# EAGLE design YOTSUBA_-Y-Z_ver.1.2b (EAGLE 9.6.2)
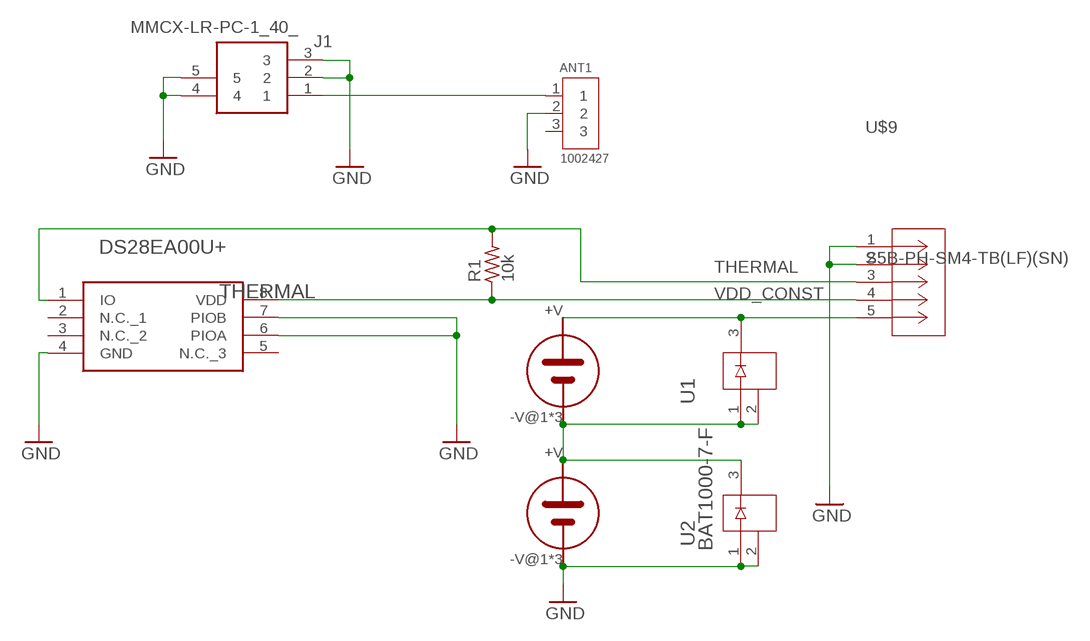
[diagram p0: schematic, sheet 1]

## Parts
ANT1  1002427  [ANTENNA_1002427]
J1  MMCX-LR-PC-1_40_  [MMCXLRPC140]
R1  10k  R-US_R0805  [R0805]
THERMAL  DS28EA00U+  [SOP65P490X110-8N]
U1  BAT1000-7-F  [SOT23_BAT_DIO]
U2  BAT1000-7-F  [SOT23_BAT_DIO]
U$2  3G30A  [SOLAR_3G30A]
U$3  3G30A  [SOLAR_3G30A]
U$9  S5B-PH-SM4-TB(LF)(SN)  [CONN_S5B-PH-SM4-TB_JST]

## Nets
GND [GND]: ANT1.2 J1.2 J1.3 J1.4 J1.5 THERMAL.4(GND) THERMAL.6(PIOA) THERMAL.7(PIOB) U2.1 U2.2 U$3.-V@1(-V) U$3.-V@2(-V) U$3.-V@3(-V) U$9.1 U$9.2
N$5: U1.1 U1.2 U2.3 U$2.-V@1(-V) U$2.-V@2(-V) U$2.-V@3(-V) U$3.+V
N$6: U1.3 U$2.+V U$9.5
RF2 [ANTENNA]: ANT1.1 J1.1
THERMAL: R1.2 THERMAL.1(IO) U$9.3
VDD_CONST: R1.1 THERMAL.8(VDD) U$9.4
Unconnected: ANT1.3 THERMAL.2(N.C._1) THERMAL.3(N.C._2) THERMAL.5(N.C._3)

## Library data of the parts
ANT1 = 1002427:1002427: RF ANT 868MHZ/915MHZ STAMPED MET; DESCRIPTION: 868MHz, 915MHz, 1.575GHz Beidou, GLONASS, GPS, ISM, LoRa, LPWAN, Sigfox Stamped Metal RF Antenna 868MHz, 915MHz, 1.561GHz ~ 1.602GHz 3dBi Solder Surface Mount; DIGI-KEY_PART_NUMBER: 478-1002427TR-ND; MF: Ethertronics/AVX; MP: 1002427; PACKAGE: None; PURCHASE-URL: https://pricing.snapeda.com/search/part/1002427/?ref=eda
J1 = MMCX-LR-PC-1_40_:MMCX-LR-PC-1_40_: RF Connectors / Coaxial Connectors MINI PUSH-ON CONN RECEPT RA Source: Datasheet <https://componentsearchengine.com/Datasheets/1/MMCX-LR-PC-1(40).pdf>; DESCRIPTION: RF Connectors / Coaxial Connectors MINI PUSH-ON CONN RECEPT RA; HEIGHT: 3.95mm; MANUFACTURER_NAME: Hirose; MANUFACTURER_PART_NUMBER: MMCX-LR-PC-1(40); MOUSER_PART_NUMBER: 798-MMCX-LR-PC-1(40); MOUSER_PRICE-STOCK: https://www.mouser.co.uk/ProductDetail/Hirose-Connector/MMCX-LR-PC-140?qs=XQjbzJWzFPVvtPijmLd%2FXQ%3D%3D
R1 = rcl:R-US_: RESISTOR, American symbol; SPICEPREFIX: R
THERMAL = DS28EA00U+:DS28EA00U+: Maxim DS28EA00U+ Temperature Sensor 8-Pin uMAX, -40 +85 C Source: Datasheet <https://datasheets.maximintegrated.com/en/ds/DS28EA00.pdf>; ARROW_PART_NUMBER: DS28EA00U+; ARROW_PRICE-STOCK: https://www.arrow.com/en/products/ds28ea00u/maxim-integrated?region=nac; DESCRIPTION: Maxim DS28EA00U+ Temperature Sensor 8-Pin uMAX, -40 +85 C; HEIGHT: 1.1mm; MANUFACTURER_NAME: Analog Devices; MANUFACTURER_PART_NUMBER: DS28EA00U+; MOUSER_PART_NUMBER: 700-DS28EA00U; MOUSER_PRICE-STOCK: https://www.mouser.co.uk/ProductDetail/Maxim-Integrated/DS28EA00U%2b?qs=7H2Jq%252ByxpJJHHt%2F9DIHuNA%3D%3D
U1 U2 = BAT1000:BAT1000-7-F; COPYRIGHT: Copyright (C) 2023 Ultra Librarian. All rights reserved.; DIGIKEY_PART_NUMBER_1: BAT1000-7FDITR-ND; DIGIKEY_PART_NUMBER_2: BAT1000-7FDICT-ND; DIGIKEY_PART_NUMBER_3: BAT1000-7FDIDKR-ND; MANUFACTURER_PART_NUMBER: BAT1000-7-F; MFR_NAME: Diodes Inc
U$2 U$3 = 3G30A_normal:3G30A
U$9 = S5B-PH-SM4:S5B-PH-SM4-TB(LF)(SN); COPYRIGHT: Copyright (C) 2023 Ultra Librarian. All rights reserved.; DIGIKEY_PART_NUMBER_1: 455-1752-2-ND; DIGIKEY_PART_NUMBER_2: 455-1752-1-ND; DIGIKEY_PART_NUMBER_3: 455-1752-6-ND; MANUFACTURER_PART_NUMBER: S5B-PH-SM4-TB(LF)(SN); MFR_NAME: JST

## Net classes
2 GND: clearance 0.5 mm to class 0, clearance 0.21 mm to class 1, clearance 0.5 mm

## Board
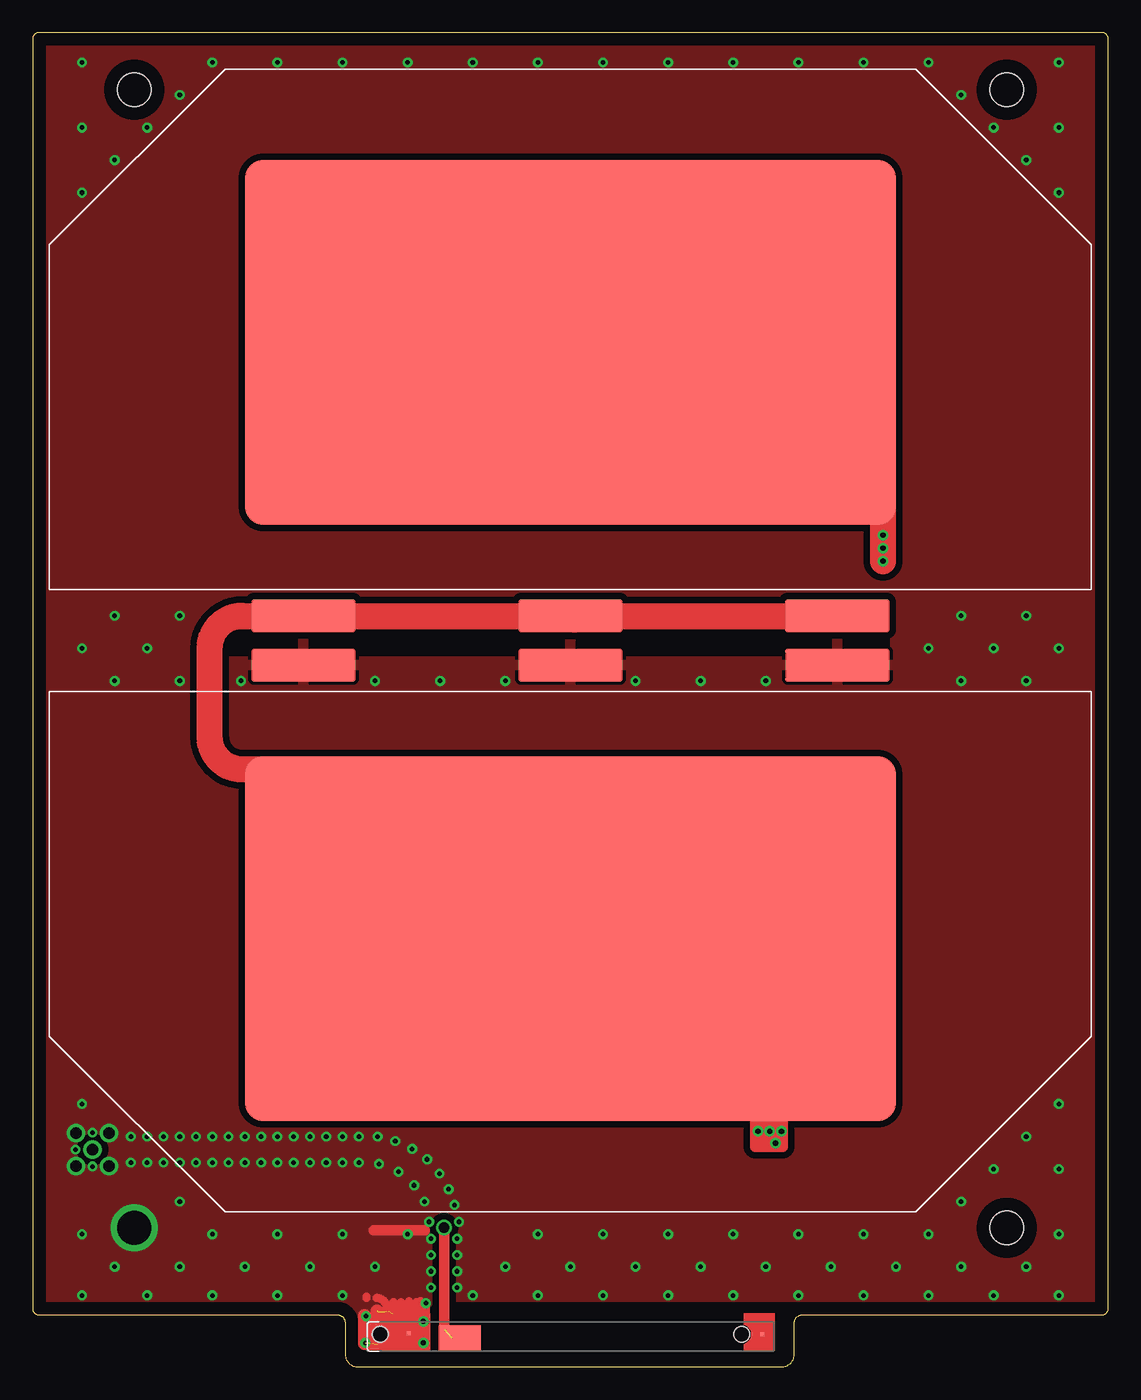
[diagram p1: board, top side]
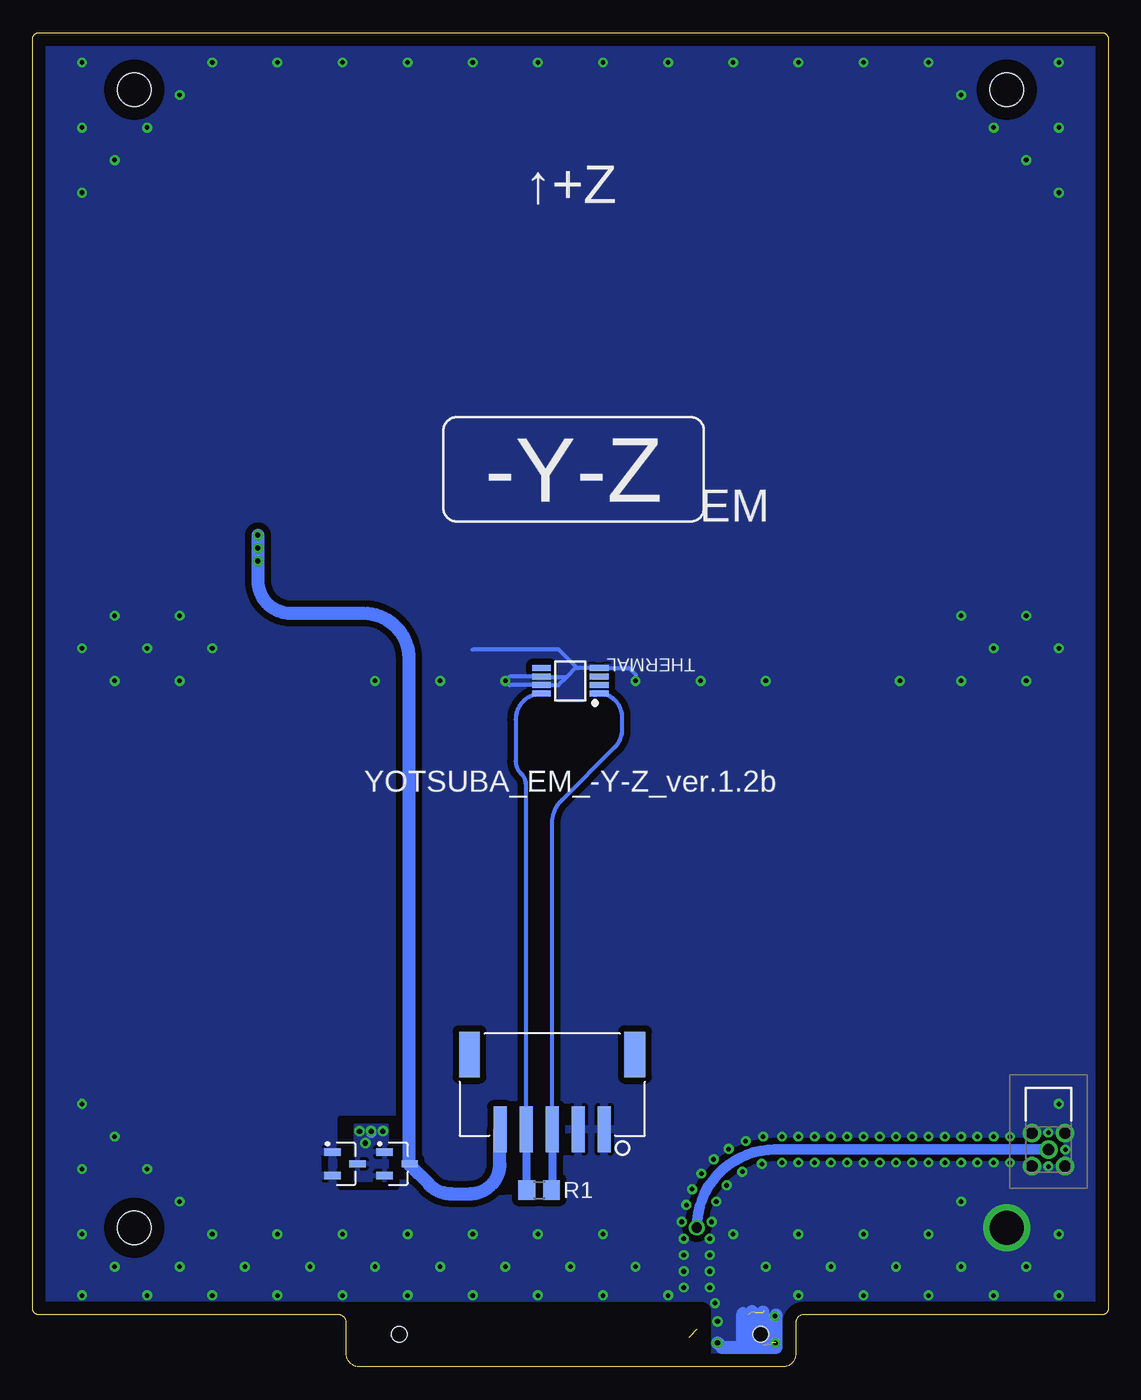
[diagram p2: board, bottom side, seen from below]

Size 82.6 x 102.5 mm. Coordinates in mm from the lower left corner, seen from the top.
Outline: 0,102 0,4.5 arc90 0.5,4 23.4,4 arc-90 24,3.4 24,1 arc90 25,0 57.5,0 arc90 58.5,1 58.5,3.4 arc-90 59.1,4 82.1,4 arc90 82.6,4.5 82.6,102 arc90 82.1,102.5 0.5,102.5 arc90 0,102
Copper layers (1*16): Top 0.035mm / dielectric 1.2mm / Bottom 0.035mm
Design rules "default *": minimum track width 6mil, minimum drill 0.35mm, track to track 6mil, track to pad 6mil, pad to pad 6mil, via to via 6mil, smd to smd 6mil, copper to edge 1mm, drill to drill 6mil, minimum pad ring 10mil, minimum via ring 8mil, stop-mask expansion 4mil, vias tented up to drill 30mil, thermal gap 10mil
Holes 2.6 mm at 74.8,10.7 7.8,98.1 74.8,98.1
tRestrict: 7 lines
bRestrict: 12 lines

### Footprints (pad centres in the part's own frame; a part is rotated, then mirrored left to right if it is on the bottom)
ANTENNA_1002427 = smd 3.2 x 1.9: 1 24.1,-1.05 | smd 0.3 x 0.3: 2 28.02,-1.375; 3 0.875,-1.325 | hole 1.2: 2.46,-1.3; 30.2,-1.3
MMCXLRPC140 = drill 0.9 pad 1.4: 1 0,0; 2 -1.27,-1.27; 3 1.27,-1.27; 4 1.27,1.27; 5 -1.27,1.27
R0805 = smd 1.3 x 1.5: 1 -0.95,0; 2 0.95,0
SOP65P490X110-8N = smd 1.425 x 0.45: 1 -2.212,0.975; 2 -2.212,0.325; 3 -2.212,-0.325; 4 -2.212,-0.975; 5 2.212,-0.975; 6 2.212,-0.325; 7 2.212,0.325; 8 2.212,0.975
SOT23_BAT_DIO = smd 0.568 x 1.259: 1 -0.915,-0.965; 2 0.915,-0.965; 3 0,0.965
SOLAR_3G30A = smd 50 x 28: +V 0,19 | smd 8 x 2.5: -V@1 -20.5,-2; -V@2 20.5,-2; -V@3 0,-2
CONN_S5B-PH-SM4-TB_JST = smd 0.991 x 3.505: 1 4,-3.453; 2 2,-3.453; 3 0,-3.453; 4 -2,-3.453; 5 -4,-3.453 | smd 1.6 x 3.505: 6 -6.35,2.297; 7 6.35,2.297

### Placement (x,y rotation side)
ANT1  56.9,1.2 180 top
J1  4.6,16.7 90 bottom
R1  43.7,13.6 0 bottom
THERMAL  41.3,52.7 180 bottom
U1  54.6,15.6 270 bottom
U2  58.6,15.6 270 bottom
U$2  41.3,59.7 0 top
U$3  41.3,51.9 180 top
U$9  42.7,21.7 0 bottom

### Tracks (layer width: path | path; a pad name or v marks a point on that pad's centre or on a via)
GND  (via drill 0.35, 0.4, 2.6)  (6 unrouted)
  Top 0.6: 30.18,3.58 30.1,3.5 v30,3.5 | 25.65,5.3 25.65,5.4 | ANT1.2 28.6,2.85 | 28.6,2.85 27.78,3.67 27.22,3.67 27.22,4.48 | 27.22,4.48 arc90 26.4,5.3 arc-90 27.22,4.48 | 28.6,2.85 28.4,2.85 28.4,3.8 | 27.7,4.05 27.7,5 | 28.3,4.05 28.3,5 | 28.9,4.1 28.9,5.05 | 29.5,4.05 29.5,5 | 29.8,4.1 29.8,5.05
  Top 0.64: 30.18,3.58 30.18,4.78
  Top 0.8: 30.1,10.5 26.2,10.5
  Top 1: 25.9,1.8 25.88,1.83 25.85,1.85 | 25.5,3.95 25.5,1.8 28.26,1.8 28.88,2.48 ANT1.2 28.88,3.5 v30,3.5 29.55,3.5 29.55,1.8 | 26.45,2.17 26.45,4.3 | 27.1,2.08 27.1,4.2
  Bottom 0.3: 48.8,55.1 42.2,55.1 40.85,53.75 | 40.85,53.75 40.77,53.67 THERMAL.4 36.83,53.67 36.8,53.7 36.3,53.2 v36.3,52.7 | 41.6,53 40.85,53.75 | 41.6,53 43.41,53 THERMAL.6 45.98,53.02 v46.3,52.7 45.98,52.38 THERMAL.7 42.23,52.38 41.6,53
  Bottom 1: v30,1.85 29.65,1.5 25.5,1.5 25.5,4 | 26.5,1.7 26.5,4.2 | 27.35,1.75 27.35,4.25 | 28.05,1.6 28.05,4.1
  other vias: 31.3,52.7 26.3,52.7 16,52.7 51.3,52.7 56.3,52.7 71.3,52.7 68.8,55.2 73.8,55.2 78.8,55.2 76.3,52.7 78.8,20.2 76.3,17.7 78.8,15.2 78.8,10.2 73.8,15.2 71.3,12.7 68.8,10.2 63.8,10.2 63.8,5.5 66.3,7.7 71.3,7.7 68.8,5.5 73.8,5.5 76.3,7.7 78.8,5.5 23.8,15.7 21.3,17.7 16.3,17.7 6.3,52.7 11.3,52.7 8.8,55.2 3.8,55.2 6.3,57.7 11.3,57.7 71.3,57.7 76.3,57.7 3.8,90.2 6.3,92.7 3.8,95.2 3.8,100.2 8.8,95.2 11.3,97.7 13.8,100.2 18.8,100.2 23.8,100.2 28.8,100.2 33.8,100.2 38.8,100.2 43.8,100.2 48.8,100.2 53.8,100.2 58.8,100.2 63.8,100.2 68.8,100.2 71.3,97.7 73.8,95.2 76.3,92.7 78.8,90.2 78.8,95.2 78.8,100.2 18.8,5.5 13.8,5.5 8.8,5.5 11.3,7.7 6.3,7.7 3.8,5.5 3.8,10.2 11.3,17.7 7.8,10.7 3.8,20.2 13.8,17.7 12.55,17.7 15.05,17.7 10.05,17.7 8.8,17.7 7.55,17.7 17.55,17.7 18.8,17.7 20.05,17.7 22.55,17.7 23.8,17.7 22.55,15.7 21.3,15.7 20.05,15.7 18.8,15.7 17.55,15.7 16.3,15.7 15.05,15.7 13.8,15.7 12.55,15.7 11.3,15.7 10.05,15.7 8.8,15.7 7.55,15.7 4.6,18 3.3,16.7 4.6,15.4 16.3,7.7 21.3,7.7 18.8,10.2 13.8,10.2 11.3,12.7 23.8,10.2 25.05,17.7 25.05,15.7 26.5,17.7 26.6,15.6 28.1,15 29.3,13.95 30.1,12.7 27.85,17.35 29.15,16.75 30.3,15.95 31.25,14.85 31.95,13.65 32.4,12.45 30.6,7.35 30.6,8.6 30.6,6.1 32.6,8.6 32.6,7.35 32.6,6.1 30.2,4.9 58.8,5.5 53.8,5.5 48.8,5.5 43.8,5.5 38.8,5.5 33.8,5.5 61.3,7.7 56.3,7.7 58.8,10.2 53.8,10.2 51.3,7.7 48.8,10.2 43.8,10.2 46.3,7.7 38.8,10.2 36.3,7.7 41.3,7.7 28.8,10.2 26.3,7.7 23.8,5.5 25.55,1.85 25.6,3.9 32.6,9.85 30.6,9.85 30.45,11.15 32.75,11.15
  pour Top: 88.65,106.6 -4.35,106.6 arc90 -4.6,106.35 -4.6,-2.15 arc90 -3.85,-2.9 88.9,-2.9 88.9,106.35 arc90
  pour Bottom: -4.9,-1.6 -4.9,107.1 arc-90 -3.9,108.1 86.3,108.1 arc-90 87.3,107.1 87.3,-1.6 arc-90 86.3,-2.6 -3.9,-2.6 arc-90
N$5  (via drill 0.4)
  Top 0.8: U$3.+V 57.6,32.9 57.6,16.9 55.5,16.9 55.5,18.4 | 55.5,18.4 55.5,19 57.2,19 57.2,18.4 v57.5,18.1 57.2,17.8 | 56.6,18 56,18 56,17.1 56.6,17.1 56.6,17.2 | v56.6,18.1 56.6,17.2 | v56.6,18.1 56.6,18.4 55.5,18.4 | v56.6,18.1 56.9,17.8 57.2,17.8 | 57.2,17.8 57.2,17.4 v57.05,17.2 56.6,17.2
  Top 2: U$2.-V@3 41.6,57.4 41.8,57.6 | 41.8,57.6 41.5,57.6 U$2.-V@3 | U$3.+V 21.6,32.9 21.6,45.9 16.1,45.9 arc-90 13.6,48.4 13.6,55.2 arc-90 16.1,57.7 U$2.-V@1 41.8,57.7 41.8,57.6 | U$2.-V@3 U$2.-V@2 61.8,57.8
  Bottom 0.8: v56.6,18.1 56.6,18
  other vias: 55.7,18.1
  pour Bottom: 55.4,18.5 57.8,18.5 57.8,14.4 55.4,14.4
N$6  (via drill 0.4)
  Top 2: U$2.+V 41.59,78.7 54.3,65.7 65.3,65.7 v65.3,61.9
  Bottom 1: v65.3,63.9 v65.3,62.9 v65.3,61.9 65.3,60.4 arc-90 62.8,57.9 57.2,57.9 arc90 53.7,54.4 53.7,15.6 U1.3 53.63,15.5 52.15,14.01 arc-45 50.43,13.3 49.01,13.3 arc-90 46.71,15.6 46.71,18.24 U$9.5
RF2  (via drill 0.8)  (1 unrouted)
  Top 0.152: ANT1.1 32.2,2.25
  Top 0.8: ANT1.1 32.6,2.25 | v31.6,10.7 31.6,2.9
  Bottom 0.8: J1.1 25.6,16.7 arc-90 v31.6,10.7
THERMAL
  Bottom 0.3: U$9.3 42.71,41.75 arc45 41.98,43.52 37.89,47.61 arc-45 37.33,48.97 37.33,49.89 arc-90 THERMAL.1 | 42.71,13.8 R1.2
  Bottom 0.6: U$9.3 42.71,18.24 42.71,13.8
VDD_CONST
  Bottom 0.3: THERMAL.8 THERMAL.8 arc-90 45.5,49.73 45.5,46.53 arc-45 45.12,45.62 45.05,45.55 arc45 44.71,44.72 44.7,44.71 44.7,18.4 U$9.4 | 44.71,13.82 R1.1
  Bottom 0.6: 44.7,18.4 44.7,13.65 R1.1

### Text on the board
bNames: ↑+Z | -Y-Z | EM | YOTSUBA_EM_-Y-Z_ver.1.2b